# Altium schematic sheet 00_Overview.SchDoc
size A3; SheetNumber: 1; SheetTotal: 8
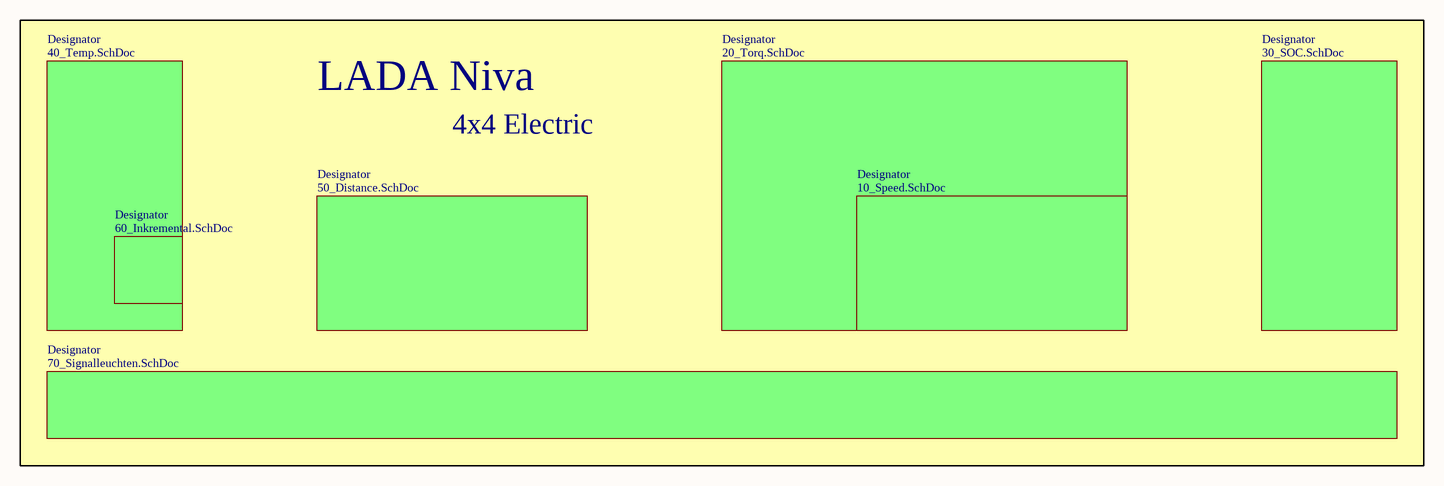
[diagram p0: 00_Overview.SchDoc]

## Sub-sheets
Designator = 20_Torq.SchDoc: no entries
Designator = 10_Speed.SchDoc: no entries
Designator = 30_SOC.SchDoc: no entries
Designator = 40_Temp.SchDoc: no entries
Designator = 70_Signalleuchten.SchDoc: no entries
Designator = 50_Distance.SchDoc: no entries
Designator = 60_Inkremental.SchDoc: no entries

## Notes on the sheet
- LADA Niva
- 4x4 Electric